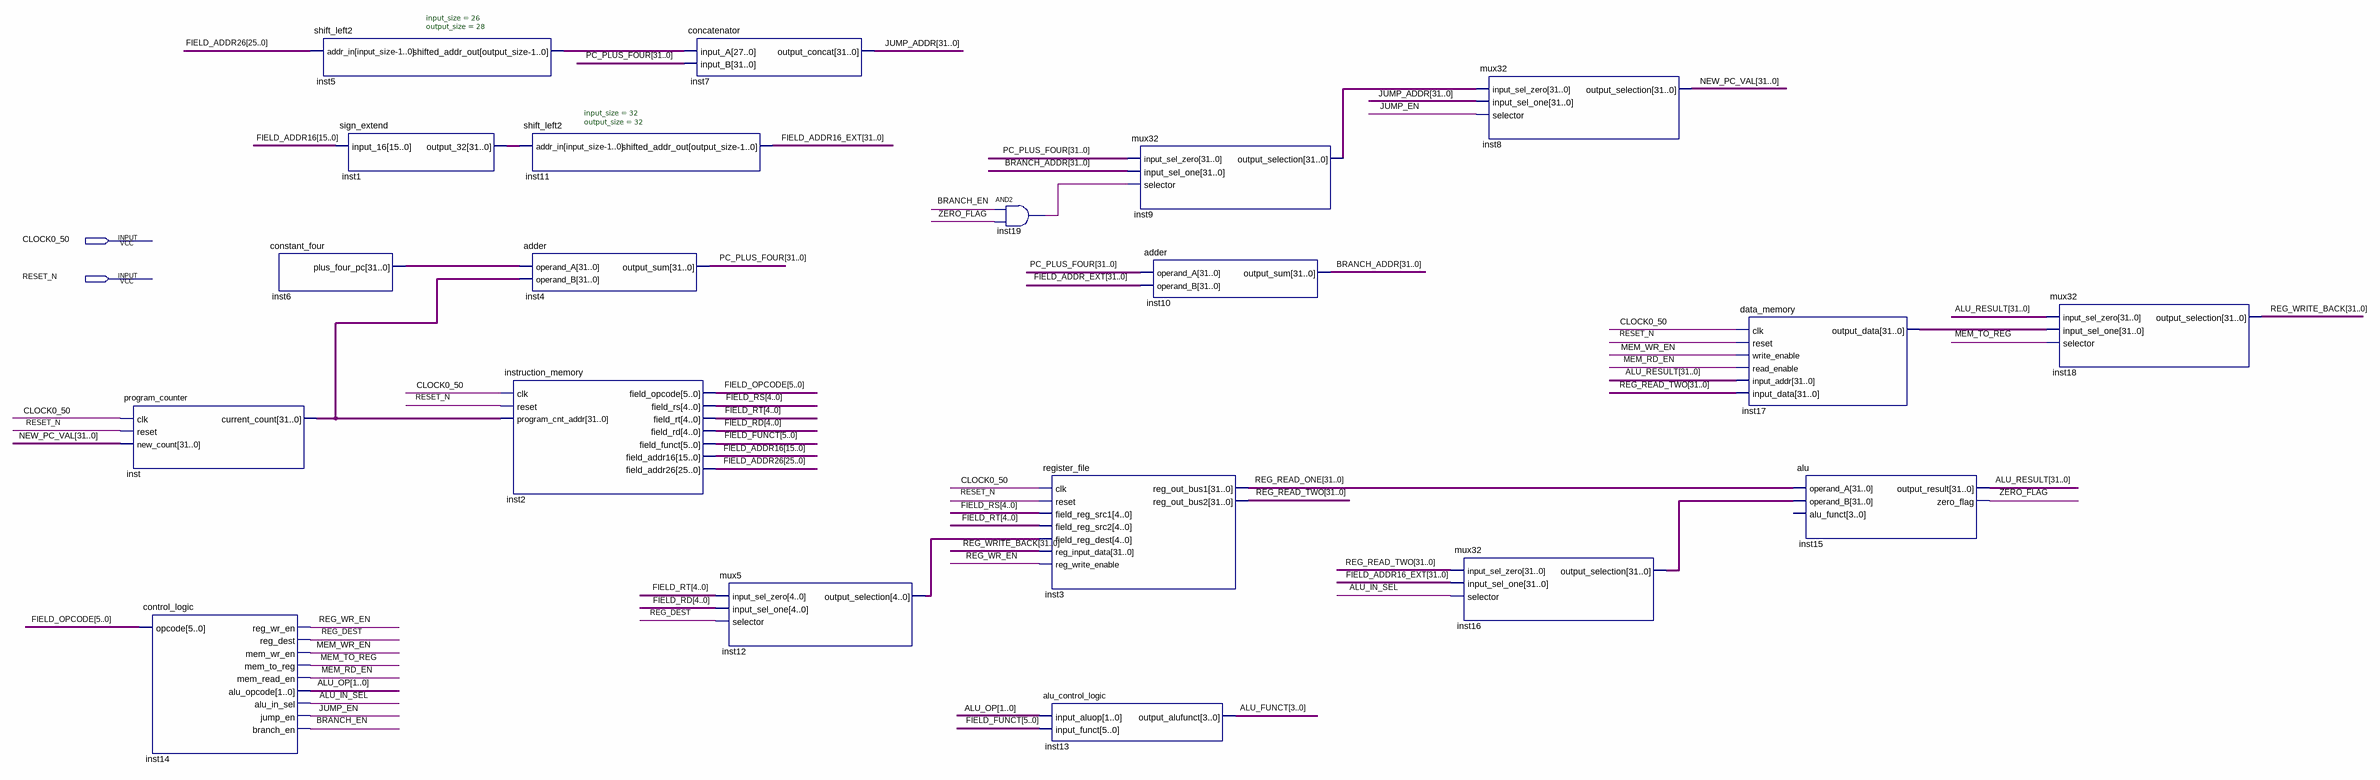
[diagram p0: schematic sheet]
// Quartus schematic mips_cpu.bdf as structural Verilog: 20 symbols, 2 pins
module mips_cpu (
  input  CLOCK0_50,
  input  RESET_N
);

  wire ALU_IN_SEL, BRANCH_EN, inst19_out, JUMP_EN, MEM_RD_EN, MEM_TO_REG, MEM_WR_EN, REG_DEST, REG_WR_EN,
       ZERO_FLAG;
  wire [1:0] ALU_OP;
  wire [3:0] ALU_FUNCT;
  wire [4:0] FIELD_RD, FIELD_RS, FIELD_RT, inst12_output_selection;
  wire [5:0] FIELD_FUNCT, FIELD_OPCODE;
  wire [15:0] FIELD_ADDR16;
  wire [25:0] FIELD_ADDR26;
  wire [27:0] inst5_shifted_addr_out;
  wire [31:0] ALU_RESULT, BRANCH_ADDR, FIELD_ADDR16_EXT, FIELD_ADDR_EXT, inst1_output_32, inst6_plus_four_pc,
       inst9_output_selection, inst16_output_selection, inst17_output_data, inst_current_count, JUMP_ADDR,
       NEW_PC_VAL, PC_PLUS_FOUR, REG_READ_ONE, REG_READ_TWO, REG_WRITE_BACK;

  program_counter inst (.clk(CLOCK0_50), .reset(RESET_N), .new_count(NEW_PC_VAL), .current_count(inst_current_count));
  control_logic inst14 (
    .opcode(FIELD_OPCODE), .reg_wr_en(REG_WR_EN), .reg_dest(REG_DEST), .mem_wr_en(MEM_WR_EN),
    .mem_to_reg(MEM_TO_REG), .mem_read_en(MEM_RD_EN), .alu_opcode(ALU_OP), .alu_in_sel(ALU_IN_SEL),
    .jump_en(JUMP_EN), .branch_en(BRANCH_EN));
  constant_four inst6 (.plus_four_pc(inst6_plus_four_pc));
  shift_left2 #(.input_size(26), .output_size(28)) inst5 (
    .addr_in(FIELD_ADDR26), .shifted_addr_out(inst5_shifted_addr_out));
  sign_extend inst1 (.input_16(FIELD_ADDR16), .output_32(inst1_output_32));
  shift_left2 #(.input_size(32), .output_size(32)) inst11 (
    .addr_in(inst1_output_32), .shifted_addr_out(FIELD_ADDR16_EXT));
  adder inst4 (.operand_A(inst6_plus_four_pc), .operand_B(inst_current_count), .output_sum(PC_PLUS_FOUR));
  instruction_memory inst2 (
    .clk(CLOCK0_50), .reset(RESET_N), .program_cnt_addr(inst_current_count), .field_opcode(FIELD_OPCODE),
    .field_rs(FIELD_RS), .field_rt(FIELD_RT), .field_rd(FIELD_RD), .field_funct(FIELD_FUNCT),
    .field_addr16(FIELD_ADDR16), .field_addr26(FIELD_ADDR26));
  concatenator inst7 (.input_A(inst5_shifted_addr_out), .input_B(PC_PLUS_FOUR), .output_concat(JUMP_ADDR));
  mux5 inst12 (
    .input_sel_zero(FIELD_RT), .input_sel_one(FIELD_RD), .selector(REG_DEST),
    .output_selection(inst12_output_selection));
  and inst19 (inst19_out, BRANCH_EN, ZERO_FLAG);
  register_file inst3 (
    .clk(CLOCK0_50), .reset(RESET_N), .field_reg_src1(FIELD_RS), .field_reg_src2(FIELD_RT),
    .field_reg_dest(inst12_output_selection), .reg_input_data(REG_WRITE_BACK), .reg_write_enable(REG_WR_EN),
    .reg_out_bus1(REG_READ_ONE), .reg_out_bus2(REG_READ_TWO));
  alu_control_logic inst13 (.input_aluop(ALU_OP), .input_funct(FIELD_FUNCT), .output_alufunct(ALU_FUNCT));
  mux32 inst9 (
    .input_sel_zero(PC_PLUS_FOUR), .input_sel_one(BRANCH_ADDR), .selector(inst19_out),
    .output_selection(inst9_output_selection));
  adder inst10 (.operand_A(PC_PLUS_FOUR), .operand_B(FIELD_ADDR_EXT), .output_sum(BRANCH_ADDR));
  mux32 inst8 (
    .input_sel_zero(inst9_output_selection), .input_sel_one(JUMP_ADDR), .selector(JUMP_EN),
    .output_selection(NEW_PC_VAL));
  mux32 inst16 (
    .input_sel_zero(REG_READ_TWO), .input_sel_one(FIELD_ADDR16_EXT), .selector(ALU_IN_SEL),
    .output_selection(inst16_output_selection));
  data_memory inst17 (
    .clk(CLOCK0_50), .reset(RESET_N), .write_enable(MEM_WR_EN), .read_enable(MEM_RD_EN),
    .input_addr(ALU_RESULT), .input_data(REG_READ_TWO), .output_data(inst17_output_data));
  alu inst15 (
    .operand_A(REG_READ_ONE), .operand_B(inst16_output_selection), .output_result(ALU_RESULT),
    .zero_flag(ZERO_FLAG));  // open: alu_funct
  mux32 inst18 (
    .input_sel_zero(ALU_RESULT), .input_sel_one(inst17_output_data), .selector(MEM_TO_REG),
    .output_selection(REG_WRITE_BACK));
endmodule
